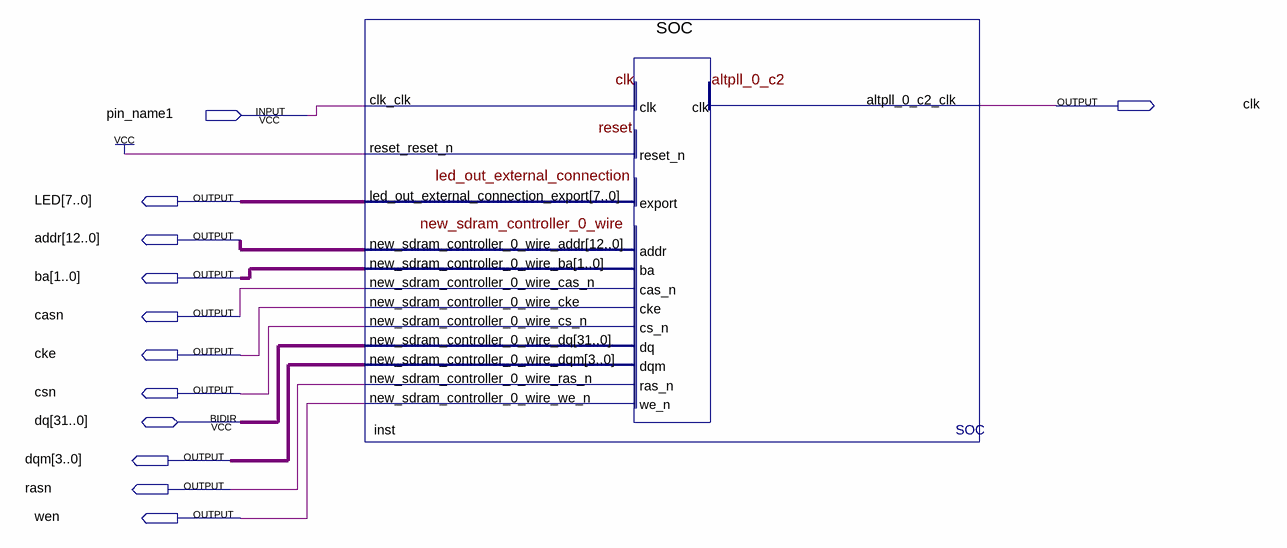
[diagram p0: schematic sheet]
// Quartus schematic TopLevel.bdf as structural Verilog: 1 symbols, 12 pins
module TopLevel (
  input  pin_name1,
  inout  [31:0] dq,
  output clk,
  output [7:0] LED,
  output [12:0] addr,
  output [1:0] ba,
  output casn,
  output cke,
  output csn,
  output [3:0] dqm,
  output rasn,
  output wen
);

  SOC inst (
    .clk_clk(pin_name1), .reset_reset_n(1'b1), .led_out_external_connection_export(LED),
    .new_sdram_controller_0_wire_addr(addr), .new_sdram_controller_0_wire_ba(ba),
    .new_sdram_controller_0_wire_cas_n(casn), .new_sdram_controller_0_wire_cke(cke),
    .new_sdram_controller_0_wire_cs_n(csn), .new_sdram_controller_0_wire_dqm(dqm),
    .new_sdram_controller_0_wire_ras_n(rasn), .new_sdram_controller_0_wire_we_n(wen), .altpll_0_c2_clk(clk),
    .new_sdram_controller_0_wire_dq(dq));
endmodule
